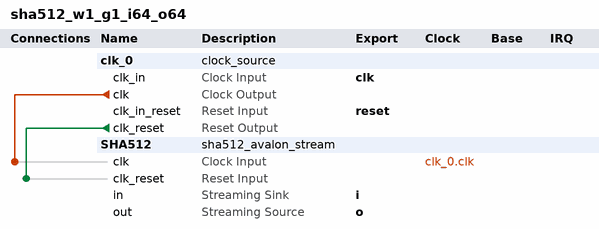
[diagram p0: system contents]
# Platform Designer (Qsys) system sha512_w1_g1_i64_o64
# Parameters at their usual value, and those the tool derives, are not listed.
package require -exact qsys 11.1
create_system sha512_w1_g1_i64_o64
set_project_property DEVICE_FAMILY STINGRAY

add_instance clk_0 clock_source 11.1
set_instance_parameter_value clk_0 clockFrequency 50000000

add_instance SHA512 sha512_avalon_stream 11.1
set_instance_parameter_value SHA512 I_BYTES 8
set_instance_parameter_value SHA512 O_BYTES 8
set_instance_parameter_value SHA512 WORDS 1
set_instance_parameter_value SHA512 BLOCK_GAP 1

# connections
add_connection clk_0.clk SHA512.clk clock
add_connection clk_0.clk_reset SHA512.clk_reset reset

# exported interfaces
add_interface clk clock sink
set_interface_property clk EXPORT_OF clk_0.clk_in
add_interface reset reset sink
set_interface_property reset EXPORT_OF clk_0.clk_in_reset
add_interface i avalon_streaming sink
set_interface_property i EXPORT_OF SHA512.in
add_interface o avalon_streaming source
set_interface_property o EXPORT_OF SHA512.out

save_system sha512_w1_g1_i64_o64.qsys
